# EAGLE design Schematic (EAGLE 6.5.0)
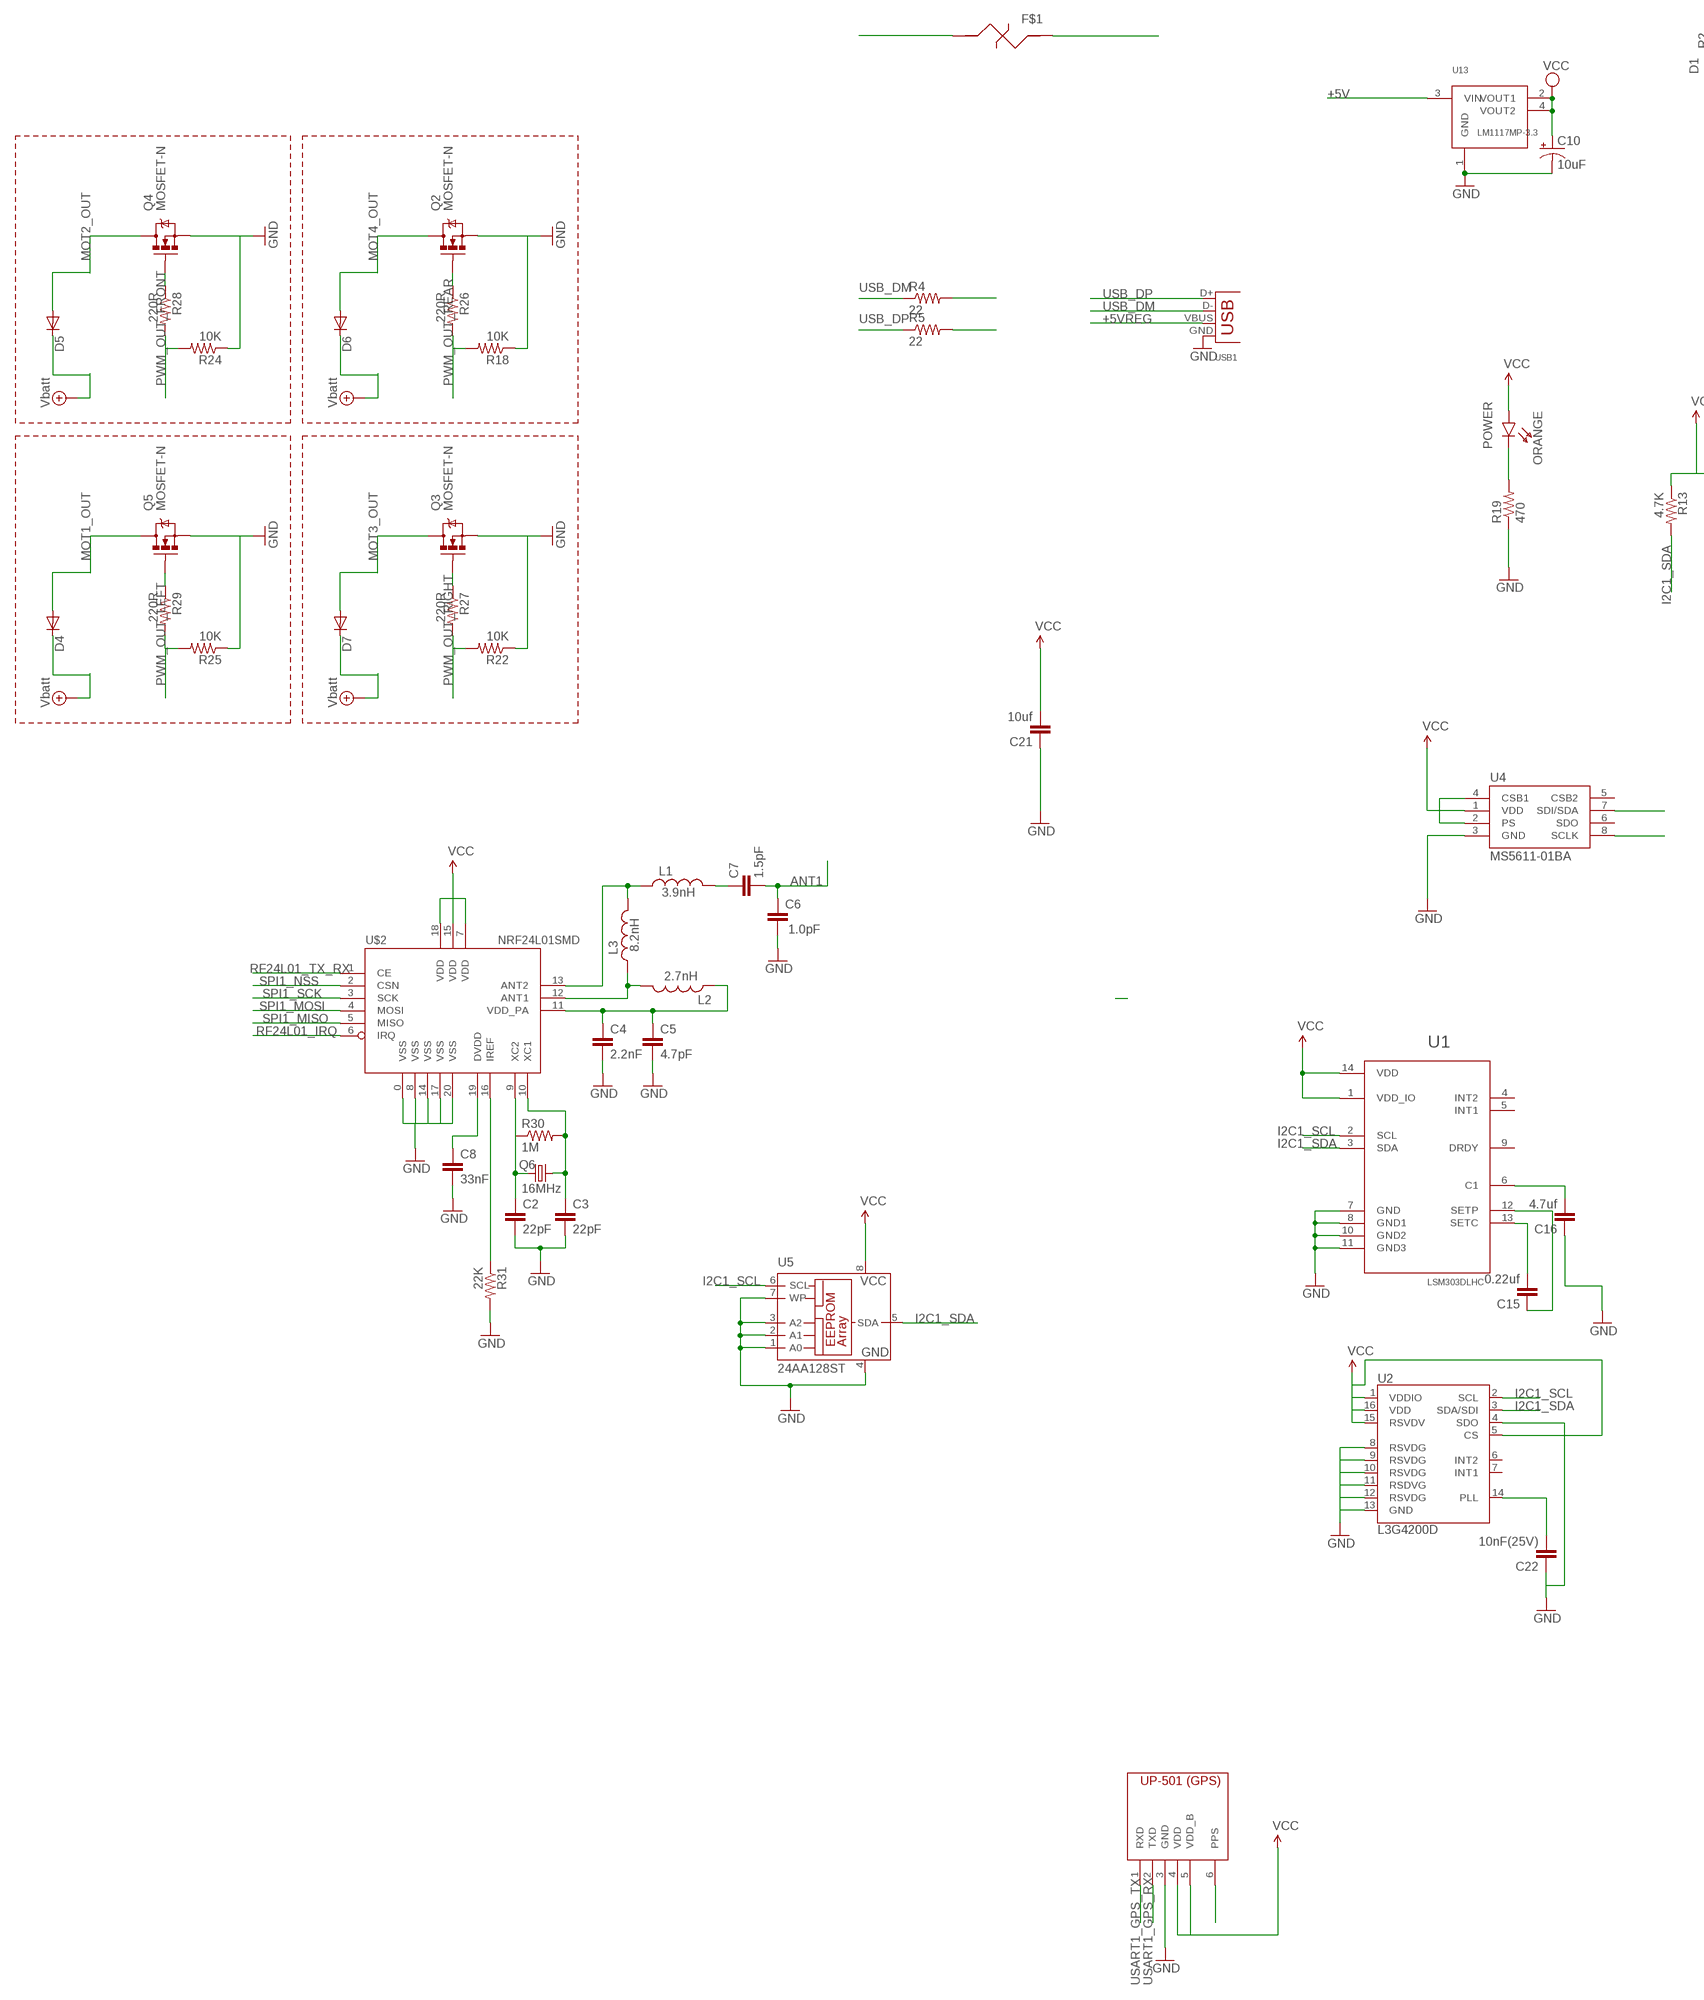
[diagram p0: schematic, sheet 1, part 1 of 2]
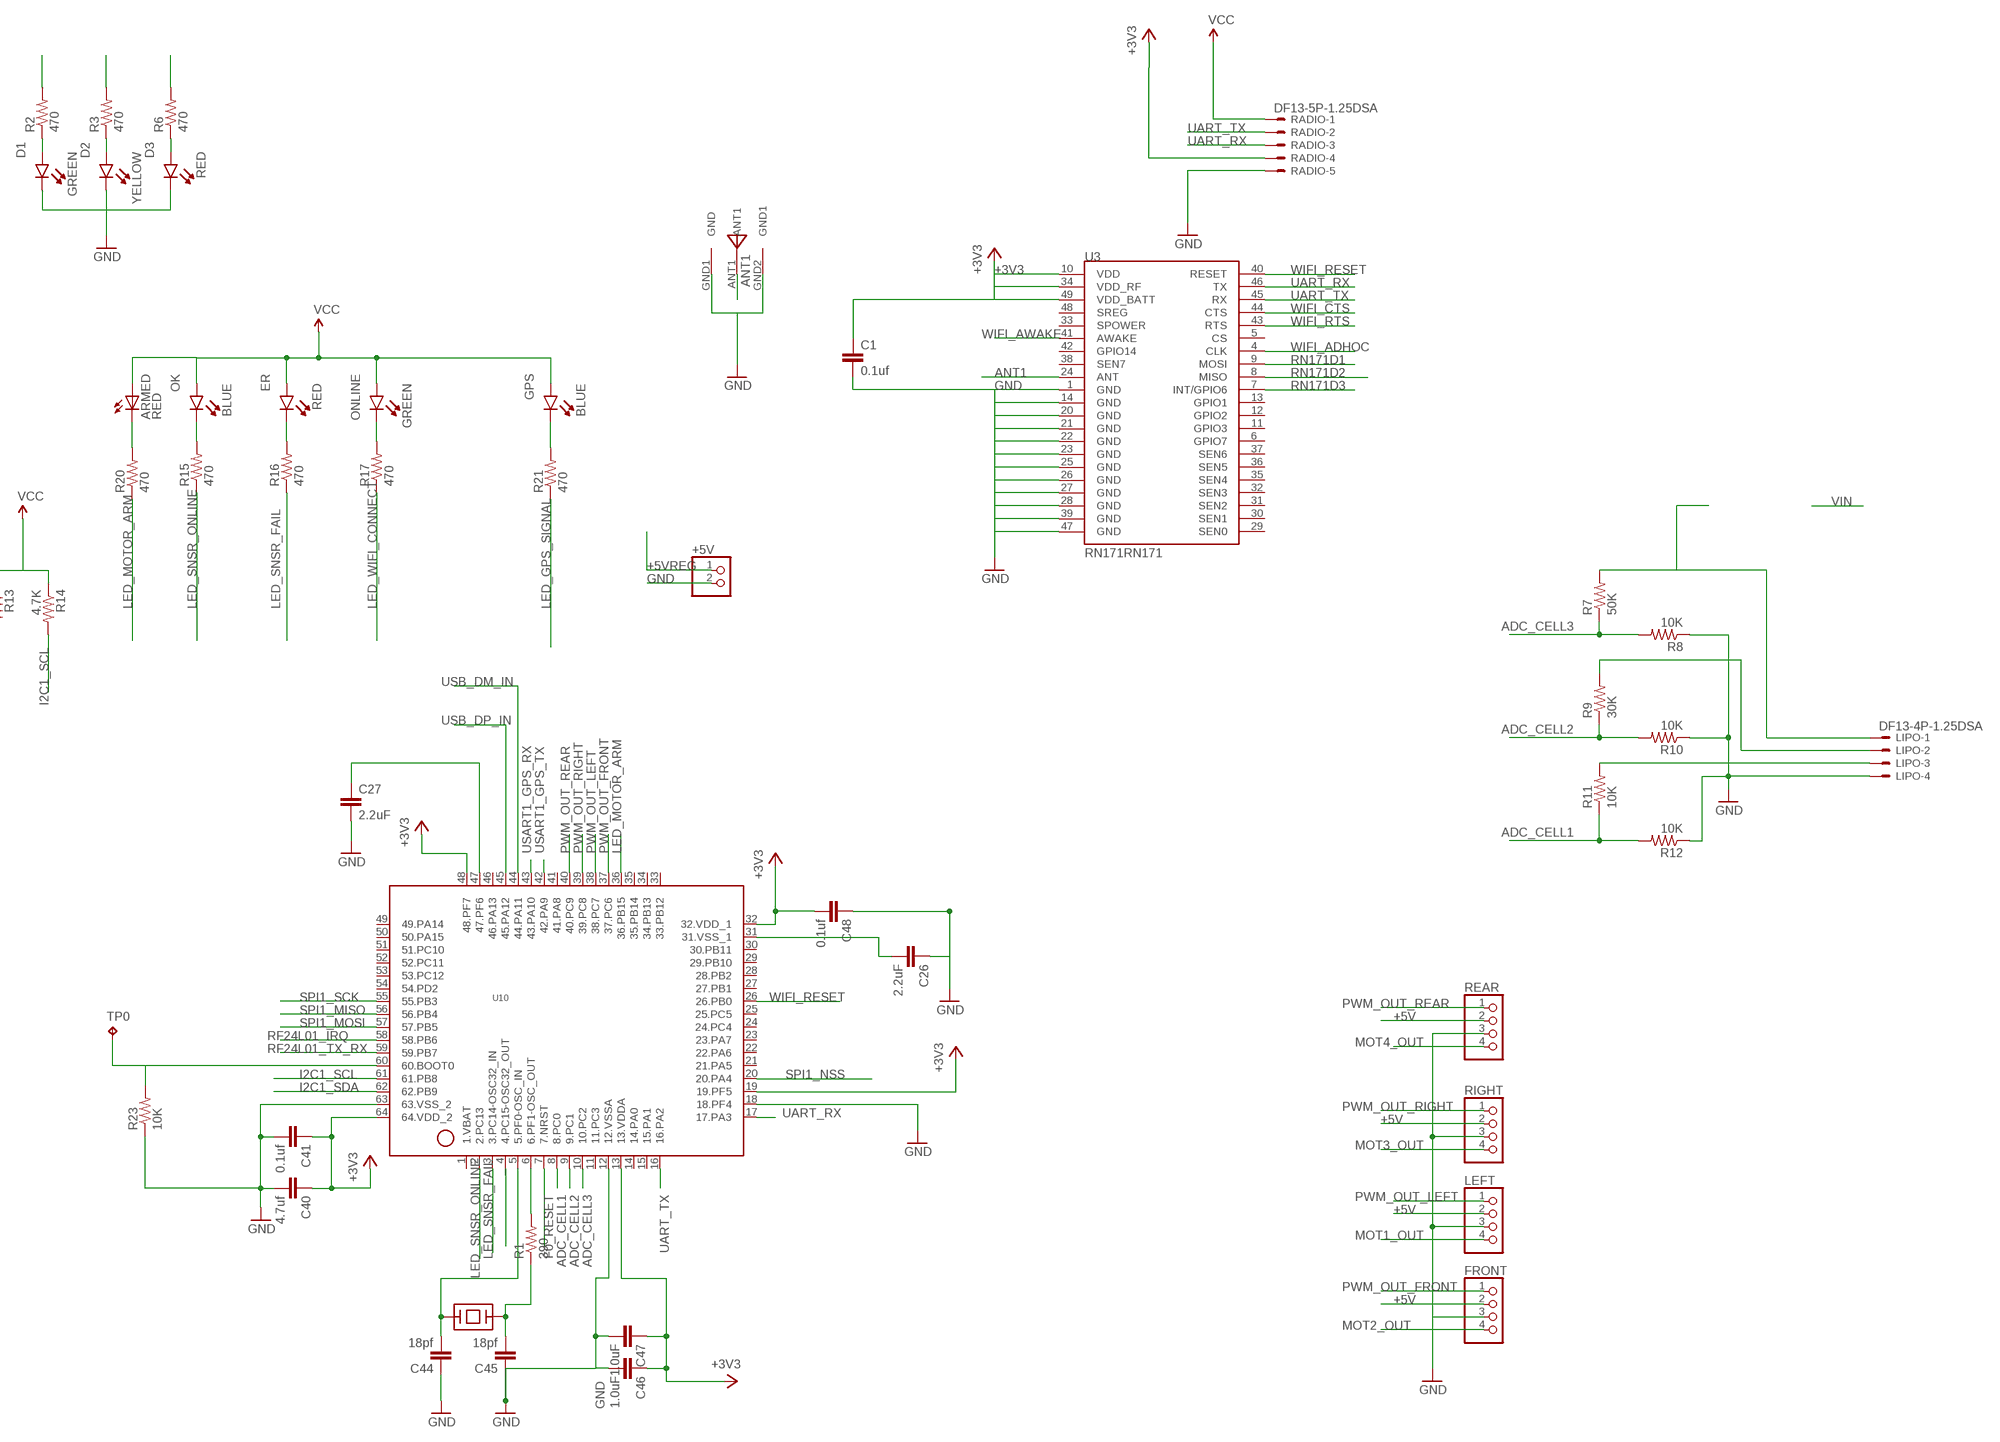
[diagram p1: schematic, sheet 1, part 2 of 2]

## Parts
+5V  PINHD-1X2  [1X02]
ARMED  RED  LED-REDLILYPAD  [LED-1206]
C1  0.1uf  CAP0805  [0805]
C2  22pF  CAP0805  [0805]
C3  22pF  CAP0805  [0805]
C4  2.2nF  CAP0805  [0805]
C5  4.7pF  CAP0805  [0805]
C6  1.0pF  CAP0805  [0805]
C7  1.5pF  CAP0805  [0805]
C8  33nF  CAP0805  [0805]
C10  10uF  CPOL-USCT3528  [CT3528]
C15  0.22uf  CAP0805  [0805]
C16  4.7uf  CAP0805  [0805]
C21  10uf  CAP0805  [0805]
C22  10nF(25V)  CAP0805  [0805]
C26  2.2uF  CAP0805  [0805]
C27  2.2uF  CAP0805  [0805]
C40  4.7uf  CAP0805  [0805]
C41  0.1uf  CAP0805  [0805]
C44  18pf  CAP0805  [0805]
C45  18pf  CAP0805  [0805]
C46  1.0uF  CAP0805  [0805]
C47  1.0uF  CAP0805  [0805]
C48  0.1uf  CAP0805  [0805]
D1  GREEN  SMD_LED0805  [LED0805]
D2  YELLOW  SMD_LED0805  [LED0805]
D3  RED  SMD_LED0805  [LED0805]
D4  DIODE-MINIMELF  [MINIMELF]
D5  DIODE-MINIMELF  [MINIMELF]
D6  DIODE-MINIMELF  [MINIMELF]
D7  DIODE-MINIMELF  [MINIMELF]
ER  RED  SMD_LED0805  [LED0805]
F1  1206L050_FUSE  [1206L050_FUSE]
FRONT  PINHD-1X4  [1X04]
GPS  BLUE  SMD_LED0805  [LED0805]
L1  3.9nH  INDUCTOR0402  [C0402]
L2  2.7nH  INDUCTOR0402  [C0402]
L3  8.2nH  INDUCTOR0402  [C0402]
LEFT  PINHD-1X4  [1X04]
LIPO  DF13-4P-1.25DSA  [DF13-4P-1.25DSA]
OK  BLUE  SMD_LED0805  [LED0805]
ONLINE  GREEN  SMD_LED0805  [LED0805]
POWER  ORANGE  SMD_LED0805  [LED0805]
Q1  ABRACON_ABM7  [ABRACON_ABM7_CERAMIC_XTAL]
Q2  MOSFET-N  MOSFET-NCHANNELSMD  [SOT23-3]
Q3  MOSFET-N  MOSFET-NCHANNELSMD  [SOT23-3]
Q4  MOSFET-N  MOSFET-NCHANNELSMD  [SOT23-3]
Q5  MOSFET-N  MOSFET-NCHANNELSMD  [SOT23-3]
Q6  16MHz  CRYSTAL5X3  [CRYSTAL-SMD-5X3]
R1  390  RESISTOR0805-RES  [0805]
R2  470  RESISTOR0805-RES  [0805]
R3  470  RESISTOR0805-RES  [0805]
R4  22  RESISTOR0805-RES  [0805]
R5  22  RESISTOR0805-RES  [0805]
R6  470  RESISTOR0805-RES  [0805]
R7  50K  RESISTOR0805-RES  [0805]
R8  10K  RESISTOR0805-RES  [0805]
R9  30K  RESISTOR0805-RES  [0805]
R10  10K  RESISTOR0805-RES  [0805]
R11  10K  RESISTOR0805-RES  [0805]
R12  10K  RESISTOR0805-RES  [0805]
R13  4.7K  RESISTOR0805-RES  [0805]
R14  4.7K  RESISTOR0805-RES  [0805]
R15  470  RESISTOR0805-RES  [0805]
R16  470  RESISTOR0805-RES  [0805]
R17  470  RESISTOR0805-RES  [0805]
R18  10K  R-US_R0603  [R0603]
R19  470  RESISTOR0805-RES  [0805]
R20  470  RESISTOR0805-RES  [0805]
R21  470  RESISTOR0805-RES  [0805]
R22  10K  R-US_R0603  [R0603]
R23  10K  RESISTOR0805-RES  [0805]
R24  10K  R-US_R0603  [R0603]
R25  10K  R-US_R0603  [R0603]
R26  220R  R-US_R0603  [R0603]
R27  220R  R-US_R0603  [R0603]
R28  220R  R-US_R0603  [R0603]
R29  220R  R-US_R0603  [R0603]
R30  1M  RESISTOR0805-RES  [0805]
R31  22K  RESISTOR0402-RES  [0402-RES]
RADIO  DF13-5P-1.25DSA  [DF13-5P-1.25DSA]
REAR  PINHD-1X4  [1X04]
RIGHT  PINHD-1X4  [1X04]
TP0  TPTP15R  [TP15R]
U1  LSM303DLHC  [LGA3X5X1-14L]
U2  L3G4200D  [LGA16-4X4]
U3  RN171RN171  [RN171]
U4  MS5611-01BA  [MS5611-01BA]
U5  24AA128ST  [TSSOP8]
U10  STM32F051XXX  [STM32F051XXX_LPFP64]
U13  LM1117MP-3.3  LM1117  [SOT223]
U$1  U.FLCONNECTOR  [U.FLCONNECTOR]
U$2  NRF24L01SMD  [QFN20]
U$4  UP501  [UP-501]
USB1  DX2R005HN2E700  USB-MB-S  [USB-MB-S]

## Nets
+3V3: ARMED.A C1.1 C10.+ C21.2 C40.1 C41.1 C46.1 C47.1 C48.2 ER.P$1(A) GPS.P$1(A) OK.P$1(A) ONLINE.P$1(A) POWER.P$1(A) R13.1 R14.1 RADIO.4 U1.1(VDD_IO) U1.14(VDD) U2.1(VDDIO) U2.5(CS) U2.15(RSVDV) U2.16(VDD) U3.10(VDD) U3.34(VDD_RF) U3.49(VDD_BATT) U4.1(VDD) U4.2(PS) U4.4(CSB1) U5.8(VCC) U10.13(13.VDDA) U10.19(19.PF5) U10.32(32.VDD_1) U10.48(48.PF7) U10.64(64.VDD_2) U13.2(VOUT1) U13.4(VOUT2) U$2.7(VDD) U$2.15(VDD) U$2.18(VDD) U$4.4(VDD) U$4.5(VDD_B) ; supply symbol labelled VCC
+5V: D4.C D5.C D6.C D7.C F1.P$2 FRONT.2 LEFT.2 RADIO.1 REAR.2 RIGHT.2 U13.3(VIN) ; supply symbol labelled VCC, Vbatt
+5VREG: +5V.1 F1.P$1 USB1.VBUS
ADC_CELL1: R11.1 R12.2 U10.8(8.PC0)
ADC_CELL2: R9.1 R10.2 U10.9(9.PC1)
ADC_CELL3: R7.1 R8.2 U10.10(10.PC2)
ANT1: C6.2 C7.2 U3.24(ANT) U$1.ANT1
F0_RESET: U10.7(7.NRST)
GND [power]: +5V.2 C1.2 C2.2 C3.2 C4.2 C5.2 C6.1 C8.2 C10.- C16.1 C21.1 C22.1 C26.1 C27.2 C40.2 C41.2 C44.1 C45.1 C46.2 C47.2 C48.1 D1.C D2.C D3.C FRONT.3 LEFT.3 LIPO.4 Q2.2(S) Q3.2(S) Q4.2(S) Q5.2(S) R8.1 R10.1 R12.1 R18.1 R19.1 R22.1 R23.1 R24.1 R25.1 R31.2 RADIO.5 REAR.3 RIGHT.3 U1.7(GND) U1.8(GND1) U1.10(GND2) U1.11(GND3) U2.4(SDO) U2.8(RSVDG) U2.9(RSVDG) U2.10(RSVDG) U2.11(RSDVG) U2.12(RSVDG) U2.13(GND) U3.1(GND) U3.14(GND) U3.20(GND) U3.21(GND) U3.22(GND) U3.23(GND) U3.25(GND) U3.26(GND) U3.27(GND) U3.28(GND) U3.39(GND) U3.47(GND) U4.3(GND) U5.1(A0) U5.2(A1) U5.3(A2) U5.4(GND) U5.7(WP) U10.12(12.VSSA) U10.18(18.PF4) U10.63(63.VSS_2) U13.1(GND) U$1.GND1(GND) U$1.GND2(GND1) U$2.0(VSS) U$2.8(VSS) U$2.14(VSS) U$2.17(VSS) U$2.20(VSS) U$4.3(GND) USB1.GND
I2C1_SCL: R14.2 U1.2(SCL) U2.2(SCL) U4.8(SCLK) U5.6(SCL) U10.61(61.PB8)
I2C1_SDA: R13.2 U1.3(SDA) U2.3(SDA/SDI) U4.7(SDI/SDA) U5.5(SDA) U10.62(62.PB9)
LED_GPS_SIGNAL: R21.1 U$4.6(PPS)
LED_MOTOR_ARM: R20.1 U10.36(36.PB15)
LED_SNSR_FAIL: R16.1 U10.3(3.PC14-OSC32_IN)
LED_SNSR_ONLINE: R15.1 U10.2(2.PC13)
LED_WIFI_CONNECT: R17.1 U10.4(4.PC15-OSC32_OUT)
MOT1_OUT: D4.A LEFT.4 Q5.3(D)
MOT2_OUT: D5.A FRONT.4 Q4.3(D)
MOT3_OUT: D7.A Q3.3(D) RIGHT.4
MOT4_OUT: D6.A Q2.3(D) REAR.4
N$1: D1.P$1(A) R2.1
N$3: C2.1 Q6.1 R30.1 U$2.9(XC2)
N$4: D2.P$1(A) R3.1
N$5: R1.2 U10.6(6.PF1-OSC_OUT)
N$6: D3.P$1(A) R6.1
N$7: C3.1 Q6.3 R30.2 U$2.10(XC1)
N$8: C16.2 U1.6(C1)
N$9: OK.C R15.2
N$10: L1.1 L3.2 U$2.13(ANT2)
N$11: C4.1 C5.1 L2.1 U$2.11(VDD_PA)
N$12: C15.1 U1.12(SETP)
N$13: C15.2 U1.13(SETC)
N$14: ER.C R16.2
N$15: ARMED.C R20.2
N$16: LIPO.3 R11.2
N$17: LIPO.2 R9.2
N$18: L2.2 L3.1 U$2.12(ANT1)
N$19: ONLINE.C R17.2
N$20: C7.1 L1.2
N$21: POWER.C R19.2
N$22: R31.1 U$2.16(IREF)
N$23: C8.1 U$2.19(DVDD)
N$25: R23.2 TP0.TP U10.60(60.BOOT0)
N$27: C22.2 U2.14(PLL)
N$30: GPS.C R21.2
N$31: C26.2 U10.31(31.VSS_1)
N$32: C27.1 U10.47(47.PF6)
N$45: Q5.1(G) R29.1
N$46: Q4.1(G) R28.1
N$47: Q2.1(G) R26.1
N$48: Q3.1(G) R27.1
OSC_IN: C44.2 Q1.P$1 U10.5(5.PF0-OSC_IN)
OSC_OUT: C45.2 Q1.P$2 R1.1
PWM_OUT_FRONT: FRONT.1 R24.2 R28.2 U10.37(37.PC6)
PWM_OUT_LEFT: LEFT.1 R25.2 R29.2 U10.38(38.PC7)
PWM_OUT_REAR: R18.2 R26.2 REAR.1 U10.40(40.PC9)
PWM_OUT_RIGHT: R22.2 R27.2 RIGHT.1 U10.39(39.PC8)
RF24L01_IRQ: U10.58(58.PB6) U$2.6(IRQ)
RF24L01_TX_RX: U10.59(59.PB7) U$2.1(CE)
RN171D1: R2.2 U3.9(MOSI)
RN171D2: R3.2 U3.8(MISO)
RN171D3: R6.2 U3.7(INT/GPIO6)
SPI1_MISO: U10.56(56.PB4) U$2.5(MISO)
SPI1_MOSI: U10.57(57.PB5) U$2.4(MOSI)
SPI1_NSS: U10.20(20.PA4) U$2.2(CSN)
SPI1_SCK: U10.55(55.PB3) U$2.3(SCK)
UART_RX: RADIO.3 U3.46(TX) U10.17(17.PA3)
UART_TX: RADIO.2 U3.45(RX) U10.16(16.PA2)
USART1_GPS_RX: U10.43(43.PA10) U$4.2(TXD)
USART1_GPS_TX: U10.42(42.PA9) U$4.1(RXD)
USB_DM: R4.1 USB1.D-
USB_DM_IN: R4.2 U10.44(44.PA11)
USB_DP: R5.1 USB1.D+
USB_DP_IN: R5.2 U10.45(45.PA12)
VIN_PROTECTED: LIPO.1 R7.2
WIFI_ADHOC: U3.4(CLK)
WIFI_AWAKE: U3.41(AWAKE)
WIFI_CTS: U3.44(CTS)
WIFI_RESET: U3.40(RESET) U10.26(26.PB0)
WIFI_RTS: U3.43(RTS)
Unconnected: U1.4(INT2) U1.5(INT1) U1.9(DRDY) U2.6(INT2) U2.7(INT1) U3.5(CS) U3.6(GPIO7) U3.11(GPIO3) U3.12(GPIO2) U3.13(GPIO1) U3.29(SEN0) U3.30(SEN1) U3.31(SEN2) U3.32(SEN3) U3.33(SPOWER) U3.35(SEN4) U3.36(SEN5) U3.37(SEN6) U3.38(SEN7) U3.42(GPIO14) U3.48(SREG) U4.5(CSB2) U4.6(SDO) U10.1(1.VBAT) U10.11(11.PC3) U10.14(14.PA0) U10.15(15.PA1) U10.21(21.PA5) U10.22(22.PA6) U10.23(23.PA7) U10.24(24.PC4) U10.25(25.PC5) U10.27(27.PB1) U10.28(28.PB2) U10.29(29.PB10) U10.30(30.PB11) U10.33(33.PB12) U10.34(34.PB13) U10.35(35.PB14) U10.41(41.PA8) U10.46(46.PA13) U10.49(49.PA14) U10.50(50.PA15) U10.51(51.PC10) U10.52(52.PC11) U10.53(53.PC12) U10.54(54.PD2)

## Library data of the parts
+5V = pinhead:PINHD-1X2: PIN HEADER
ARMED = SparkFun-LED:LED-RED: Assorted Red LEDs LilyPad 1206- DIO-09912 1206- DIO-00809 0603- DIO-00819; PROD_ID: DIO-09912
C1-C8 C26 C27 C40 C41 C44-C48 = SparkFun-Passives:CAP: Capacitor Standard 0603 ceramic capacitor, and 0.1" leaded capacitor.
C10 = rcl:CPOL-US: POLARIZED CAPACITOR, American symbol
C15 C16 C21 C22 = SparkFun:CAP: Capacitor Standard 0603 ceramic capacitor, and 0.1" leaded capacitor.
D1-D3 ER GPS OK ONLINE POWER = SoftwareLogisticsParts:SMD_LED0805
D4-D7 = palmquad_alpha:DIODE-: DIODE
F1 = SoftwareLogisticsParts:1206L050_FUSE
FRONT LEFT REAR RIGHT = pinhead:PINHD-1X4: PIN HEADER
L1-L3 = SparkFun:INDUCTOR: Inductors Basic Inductor/Choke - 0603 and 1206. Footprints are not proven and vary greatly between part numbers.
LIPO = pixhawk2:DF13-4P-1.25?
Q1 = Nwazet.Go:ABRACON_ABM7
Q2-Q5 = palmquad_alpha:MOSFET-NCHANNEL
Q6 = SparkFun:CRYSTAL: Crystals Various standard crystals. Proven footprints. Spark Fun Electronics SKU : COM-00534
R1-R17 R19-R21 R23 R30 = SparkFun-Passives:RESISTOR: Resistor Basic schematic elements and footprints for 0603, 1206, and PTH resistors.
R18 R22 R24-R29 = rcl:R-US_: RESISTOR, American symbol
R31 = SparkFun:RESISTOR: Resistor Basic schematic elements and footprints for 0603, 1206, and PTH resistors.
RADIO = pixhawk2:DF13-5P-1.25?
TP0 = testpad:TP: Test pad
U1 = SoftwareLogisticsParts (2):LSM303DLHC: 3D Accelerometer and 3D Magenetometer Module ST Micro Electronics
U2 = SparkFun:L3G4200D: L3G4200D Three-axis, digital output gyroscope The L3G4200D is a low-power three-axis angular rate sensor, has a full scale of ±250/±500/±2000 dps and is capable of measuring rates with a user-selectable bandwidth. It includes a sensing element and an IC interface capable of providing the measured angular rate to the external world through a digital interface (I2C/SPI). Package: 4x4x1.1 LGA-16 (LGA16-4x4.PAC)
U3 = SparkFun-RF:RN171: WiFi Module
U4 = 3DRobotics:MS5611-01BA: MS5611-01BA The MS5611-01BA is a new generation of high resolution altimeter sensors from MEAS Switzerland with SPI and I 2 C bus interface. It is optimized for altimeters and variometers with an altitude resolution of 10 cm. The sensor module includes a high linearity pressure sensor and an ultra low power 24 bit ?? ADC with internal factory calibrated coefficients. It provides a precise digital 24 Bit pressure and temperature value and different operation modes that allow the user to optimize for conversion speed and current consumption. A high resolution temperature output allows the implementation of an altimeter/thermometer function without any additional sensor. The MS5611-01BA can be interfaced to virtually any microcontroller. The communication protocol is simple, without the need of programming internal registers in the device. Small dimensions of only 5.0 mm x 3.0 mm and a height of 1.7 mm allow for integration in mobile devices. This new sensor module generation is based on leading MEMS technology and latest benefits from MEAS Switzerland proven experience and know-how in high volume manufacturing of altimeter modules, which have been widely used for over a decade. The sensing principle employed leads to very low hysteresis and high stability of both pressure and temperature signal. High resolution module, 10 cm Fast conversion down to 1 ms Low power, 1 µA (standby < 0.15 µA) QFN package 5.0 x 3.0 x 1.7 mm3 Supply voltage 1.8 to 3.6 V Integrated digital pressure sensor (24 bit ?? ADC) Operating range: 10 to 1200 mbar, -40 to +85 °C I2C and SPI interface up to 20 MHz No external components (Internal oscillator) Excellent long term stability; DATASHEET: http://www.meas-spec.com/downloads/MS5611-01BA01.pdf; LINK: http://www.meas-spec.com/product/t_product.aspx?id=8503#; MFGPN: MS5611-01BA
U5 = microchip:24*: Serial EEPROM I2C; MF: MICROCHIP; MPN: 24AA128-I/ST; OC_FARNELL: unknown; OC_NEWARK: 92C6843
U10 = Nwazet.Go:STM32F051XXX
U13 = GHI:LM1117
U$1 = SoftwareLogisticsParts:U.FLCONNECTOR
U$2 = SparkFun-RF:NRF24L01: 2.4GHz Low Power Transceiver This is the very popular, low cost, very low power RF transceiver from Nordic Semiconductor. Simple SPI interface. SKU: COM-00690
U$4 = SoftwareLogisticsParts (2):UP501
USB1 = con-usb-3:USB: USB Connectors

## Net classes
0 default: width 0.178 mm, drill 0.381 mm, clearance 0.178 mm

## Board
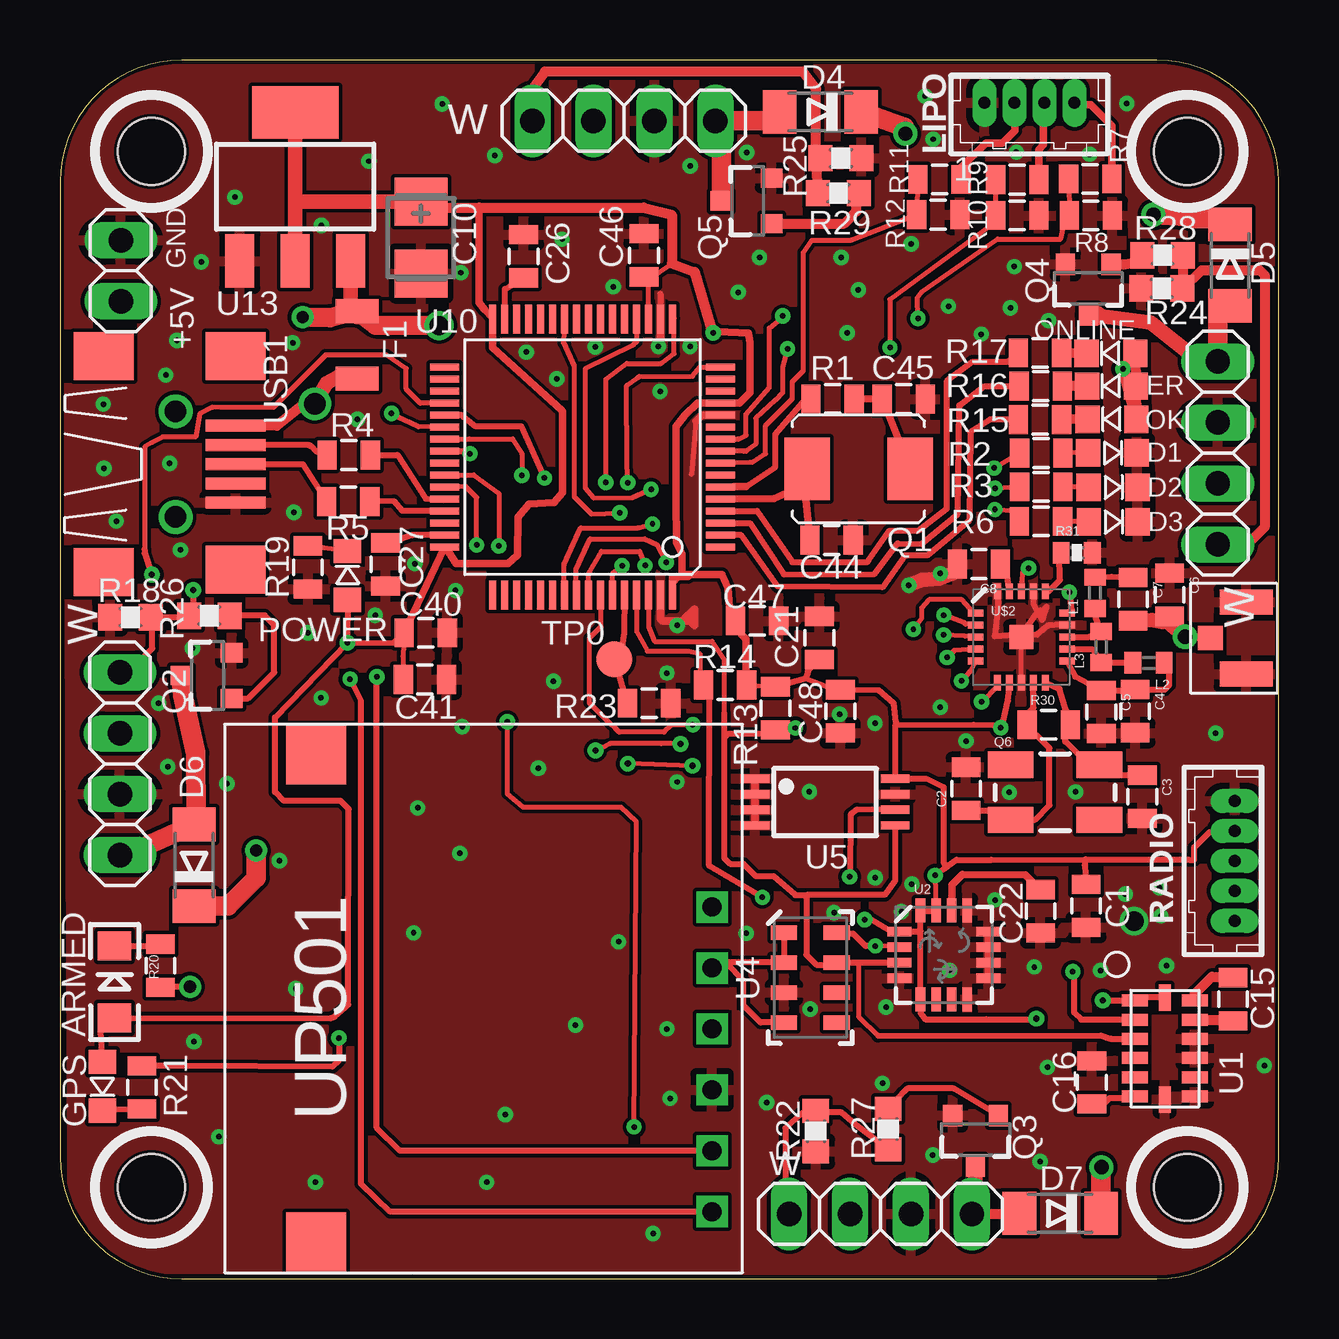
[diagram p2: board, top side]
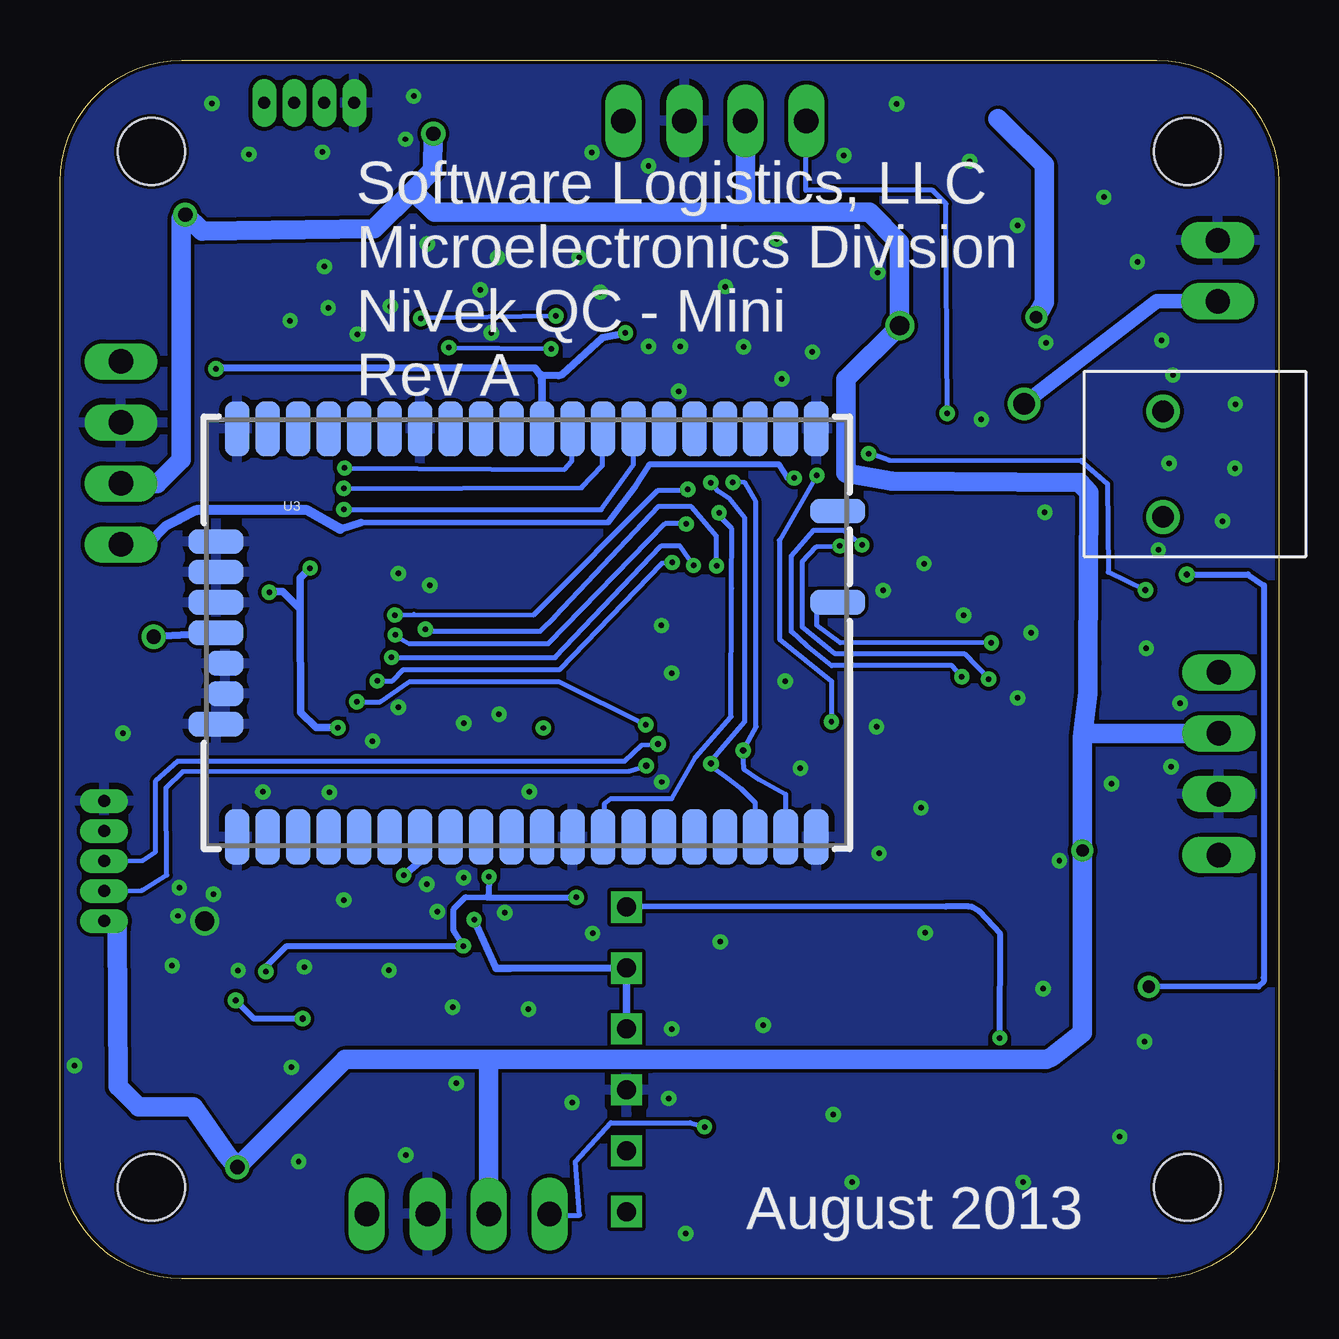
[diagram p3: board, bottom side, seen from below]

Size 50.8 x 50.8 mm. Coordinates in mm from the lower left corner, seen from the top.
Outline: 45.72,50.8 5.08,50.8 arc90 0,45.72 0,5.08 arc90 5.08,0 45.72,0 arc90 50.8,5.08 50.8,45.72 arc90 45.72,50.8
Copper layers (1*16): Top 0.035mm / dielectric 1.5mm / Bottom 0.035mm
Design rules "default *": minimum track width 6mil, minimum drill 4mil, track to track 6mil, track to pad 6mil, pad to pad 6mil, via to via 6mil, smd to smd 0mil, copper to edge 6mil, drill to drill 6mil, minimum pad ring 10mil, minimum via ring 8mil, stop-mask expansion 4mil, vias tented up to drill 12mil, thermal gap 10mil
Holes 2.79 mm at 46.99,46.99 3.81,3.81 3.81,46.99 46.99,3.81

### Footprints (pad centres in the part's own frame; a part is rotated, then mirrored left to right if it is on the bottom)
1X02 = drill 1.016 long: 1 -1.27,0; 2 1.27,0
LED-1206 = smd 1.2 x 1.4: A -1.5,0; C 1.5,0
0805 = smd 0.8 x 1.2: 1 -0.9,0; 2 0.9,0
CT3528 = smd 2 x 2.2: + -1.5,0; - 1.5,0
LED0805 = smd 1.143 x 1.016: C 0,1.016; P$1 0,-1.016
MINIMELF = smd 1.4 x 1.8: A 1.7,0; C -1.7,0
1206L050_FUSE = smd 1 x 1.8: P$1 -1.4,0; P$2 1.4,0
1X04 = drill 1.016 long: 1 -3.81,0; 2 -1.27,0; 3 1.27,0; 4 3.81,0
C0402 = smd 0.7 x 0.9: 1 -0.65,0; 2 0.65,0
DF13-4P-1.25DSA = drill 0.5 pad 0.8 long: 1 -1.875,0; 2 -0.625,0; 3 0.625,0; 4 1.875,0
ABRACON_ABM7_CERAMIC_XTAL = smd 1.9 x 2.6: P$1 -2.15,0; P$2 2.15,0
SOT23-3 = smd 0.8 x 0.9: 1 -0.95,-1; 2 0.95,-1; 3 0,1.1
CRYSTAL-SMD-5X3 = smd 1.9 x 1.1: 1 -1.85,-1.15; 2 1.85,-1.15; 3 1.85,1.15; 4 -1.85,1.15
R0603 = smd 1 x 1.1: 1 -0.85,0; 2 0.85,0
0402-RES = smd 0.7 x 0.9: 1 -0.65,0; 2 0.65,0
DF13-5P-1.25DSA = drill 0.5 pad 0.8 long: 1 -2.5,0; 2 -1.25,0; 3 0,0; 4 1.25,0; 5 2.5,0
TP15R = smd 1.5 x 1.5: TP 0,0
LGA3X5X1-14L = smd 1.1 x 0.5: 1 -1.25,2; 2 -1.25,1.2; 3 -1.25,0.4; 4 -1.25,-0.4; 5 -1.25,-1.2; 6 -1.25,-2; 8 1.25,-2; 9 1.25,-1.2; 10 1.25,-0.4; 11 1.25,0.4; 12 1.25,1.2; 13 1.25,2 | smd 0.5 x 1.1: 7 0,-2.125; 14 0,2.125
LGA16-4X4 = smd 1 x 0.4: 1 -1.85,0.975; 2 -1.85,0.325; 3 -1.85,-0.325; 4 -1.85,-0.975; 9 1.85,-0.975; 10 1.85,-0.325; 11 1.85,0.325; 12 1.85,0.975 | smd 0.4 x 1: 5 -0.975,-1.85; 6 -0.325,-1.85; 7 0.325,-1.85; 8 0.975,-1.85; 13 0.975,1.85; 14 0.325,1.85; 15 -0.325,1.85; 16 -0.975,1.85
RN171 = smd 1.016 x 2.286: 1 12.065,8.509; 2 10.795,8.509; 3 9.525,8.509; 4 8.255,8.509; 5 6.985,8.509; 6 5.715,8.509; 7 4.445,8.509; 8 3.175,8.509; 9 1.905,8.509; 10 0.635,8.509; 11 -0.635,8.509; 12 -1.905,8.509; 13 -3.175,8.509; 14 -4.445,8.509; 15 -5.715,8.509; 16 -6.985,8.509; 17 -8.255,8.509; 18 -9.525,8.509; 19 -10.795,8.509; 20 -12.065,8.509; 28 -12.065,-8.509; 29 -10.795,-8.509; 30 -9.525,-8.509; 31 -8.255,-8.509; 32 -6.985,-8.509; 33 -5.715,-8.509; 34 -4.445,-8.509; 35 -3.175,-8.509; 36 -1.905,-8.509; 37 -0.635,-8.509; 38 0.635,-8.509; 39 1.905,-8.509; 40 3.175,-8.509; 41 4.445,-8.509; 42 5.715,-8.509; 43 6.985,-8.509; 44 8.255,-8.509; 45 9.525,-8.509; 46 10.795,-8.509; 47 12.065,-8.509 | smd 2.286 x 1.016: 21 -12.954,3.81; 22 -12.954,2.54; 23 -12.954,1.27; 24 -12.954,0; 27 -12.954,-3.81; 48 12.954,5.08; 49 12.954,1.27 | smd 1.524 x 1.016: 25 -12.573,-1.27; 26 -12.573,-2.54
MS5611-01BA = smd 1.1 x 0.6: 1 -1.1,1.875; 2 -1.1,0.625; 3 -1.1,-0.625; 4 -1.1,-1.875; 5 1.1,-1.875; 6 1.1,-0.625; 7 1.1,0.625; 8 1.1,1.875
TSSOP8 = smd 0.35 x 1.2: 1 -0.975,-2.925; 2 -0.325,-2.925; 3 0.325,-2.925; 4 0.975,-2.925; 5 0.975,2.925; 6 0.325,2.925; 7 -0.325,2.925; 8 -0.975,2.925
STM32F051XXX_LPFP64 = smd 0.3 x 1.2: 1 -3.75,-5.75; 2 -3.25,-5.75; 3 -2.75,-5.75; 4 -2.25,-5.75; 5 -1.75,-5.75; 6 -1.25,-5.75; 7 -0.75,-5.75; 8 -0.25,-5.75; 9 0.25,-5.75; 10 0.75,-5.75; 11 1.25,-5.75; 12 1.75,-5.75; 13 2.25,-5.75; 14 2.75,-5.75; 15 3.25,-5.75; 16 3.75,-5.75; 33 3.75,5.75; 34 3.25,5.75; 35 2.75,5.75; 36 2.25,5.75; 37 1.75,5.75; 38 1.25,5.75; 39 0.75,5.75; 40 0.25,5.75; 41 -0.25,5.75; 42 -0.75,5.75; 43 -1.25,5.75; 44 -1.75,5.75; 45 -2.25,5.75; 46 -2.75,5.75; 47 -3.25,5.75; 48 -3.75,5.75 | smd 1.2 x 0.3: 17 5.75,-3.75; 18 5.75,-3.25; 19 5.75,-2.75; 20 5.75,-2.25; 21 5.75,-1.75; 22 5.75,-1.25; 23 5.75,-0.75; 24 5.75,-0.25; 25 5.75,0.25; 26 5.75,0.75; 27 5.75,1.25; 28 5.75,1.75; 29 5.75,2.25; 30 5.75,2.75; 31 5.75,3.25; 32 5.75,3.75; 49 -5.75,3.75; 50 -5.75,3.25; 51 -5.75,2.75; 52 -5.75,2.25; 53 -5.75,1.75; 54 -5.75,1.25; 55 -5.75,0.75; 56 -5.75,0.25; 57 -5.75,-0.25; 58 -5.75,-0.75; 59 -5.75,-1.25; 60 -5.75,-1.75; 61 -5.75,-2.25; 62 -5.75,-2.75; 63 -5.75,-3.25; 64 -5.75,-3.75
SOT223 = smd 1.219 x 2.235: 1 -2.311,-3.099; 2 0,-3.099; 3 2.311,-3.099 | smd 3.6 x 2.2: 4 0,3.099
U.FLCONNECTOR = smd 1 x 1.05: ANT1 0,-1.5 | smd 1.05 x 2.2: GND1 -1.5,0; GND2 1.5,0
QFN20 = smd 1 x 1: 0 0,0 | smd 0.65 x 0.3: 1 -1.9,1; 2 -1.9,0.5; 3 -1.9,0; 4 -1.9,-0.5; 5 -1.9,-1; 11 1.9,-1; 12 1.9,-0.5; 13 1.9,0; 14 1.9,0.5; 15 1.9,1 | smd 0.3 x 0.65: 6 -1,-1.9; 7 -0.5,-1.9; 8 0,-1.9; 9 0.5,-1.9; 10 1,-1.9; 16 1,1.9; 17 0.5,1.9; 18 0,1.9; 19 -0.5,1.9; 20 -1,1.9
UP-501 = drill 0.8 square: 1 -8.89,-8.89; 2 -6.35,-8.89; 3 -3.81,-8.89; 4 -1.27,-8.89; 5 1.27,-8.89; 6 3.81,-8.89 | smd 2.5 x 2.5: 7 10.16,7.62; 8 -10.16,7.62
USB-MB-S = smd 2.5 x 0.5: D+ 2.5,0; D- 2.5,0.8; GND 2.5,-1.6; ID 2.5,-0.8; VBUS 2.5,1.6 | smd 2.5 x 2: P$1 -3,-4.5; P$2 -3,4.5; P$3 2.5,-4.4; P$4 2.5,4.5 | drill 0.9: P$5 0,2.2; P$6 0,-2.2

### Placement (x,y rotation side)
+5V  2.54,42.01 90 top
ARMED  2.28,12.38 90 top
C1  42.77,15.54 270 top
C2  37.77,20.42 90 top
C3  45.12,20.09 270 top
C4  44.82,23.66 270 top
C5  43.4,23.62 270 top
C6  46.25,28.51 270 top
C7  44.73,28.32 270 top
C8  38.3,29.79 180 top
C10  15.05,43.4 270 top
C15  48.9,11.65 90 top
C16  43.01,8.18 270 top
C21  31.66,26.71 270 top
C22  40.87,15.31 90 top
C26  19.33,42.61 270 top
C27  13.57,29.77 270 top
C40  15.24,26.93 0 top
C41  15.21,24.98 0 top
C44  32.16,30.79 180 top
C45  35.17,36.67 180 top
C46  24.34,42.66 90 top
C47  29.06,27.42 0 top
C48  32.53,23.65 90 top
D1  43.87,34.43 270 top
D2  43.9,32.99 270 top
D3  43.9,31.55 270 top
D4  31.7,48.64 180 top
D5  48.77,42.25 270 top
D6  5.59,17.24 90 top
D7  41.69,2.72 180 top
ER  43.83,37.21 90 top
F1  12.39,38.93 90 top
FRONT  48.26,34.42 90 top
GPS  1.77,8.02 180 top
L1  43.14,28.59 90 top
L2  45.37,25.67 180 top
L3  43.39,26.33 90 top
LEFT  23.5,48.26 0 top
LIPO  40.41,49.01 180 top
OK  43.85,35.83 90 top
ONLINE  43.81,38.57 90 top
POWER  11.98,29.31 0 top
Q1  33.29,33.76 0 top
Q2  6.16,25.14 90 top
Q3  38.16,5.8 180 top
Q4  42.86,41.28 180 top
Q5  28.67,44.93 90 top
Q6  41.47,20.27 0 top
R1  32.21,36.68 180 top
R2  40.9,34.41 180 top
R3  40.9,33 180 top
R4  12.04,34.33 0 top
R5  12.02,32.4 0 top
R6  40.89,31.57 180 top
R7  42.94,45.84 0 top
R8  42.97,44.32 180 top
R9  39.9,45.81 0 top
R10  39.9,44.32 180 top
R11  36.66,45.82 0 top
R12  36.61,44.36 180 top
R13  29.82,23.77 270 top
R14  27.72,24.74 180 top
R15  40.85,35.81 0 top
R16  40.88,37.21 0 top
R17  40.85,38.59 0 top
R18  2.94,27.57 0 top
R19  10.33,29.65 90 top
R20  4.18,13.05 90 top
R21  3.41,7.98 270 top
R22  31.51,6.15 90 top
R23  24.56,23.99 180 top
R24  45.92,41.28 0 top
R25  32.55,46.71 180 top
R26  6.23,27.64 180 top
R27  34.52,6.24 270 top
R28  45.96,42.66 0 top
R29  32.45,45.25 180 top
R30  41.21,23.09 0 top
R31  42.38,30.26 0 top
RADIO  48.96,17.41 90 top
REAR  2.5,21.47 270 top
RIGHT  34.2,2.7 0 top
TP0  23.11,25.82 180 top
U1  46.05,9.6 0 top
U2  36.84,13.5 0 top
U3  31.34,26.92 0 bottom
U4  31.28,12.56 0 top
U5  31.89,19.87 270 top
U10  21.78,34.25 90 top
U13  9.8,45.52 0 top
U$1  49.44,26.7 270 top
U$2  40.07,26.75 0 top
U$4  18.29,11.68 90 top
USB1  4.82,33.95 0 top

### Tracks (layer width: path | path; a pad name or v marks a point on that pad's centre or on a via)
+3V3  (via drill 0.23, 0.25)
  Top 0.203: C40.1 14.3,25.95 C41.1 | U10.48 16.08,30.5 | R14.1 R13.1 | v36.47,16.82 U2.15 | 31.18,25.31 C21.2 | 31.1,25.02 32.17,24.61 C48.2 | U10.19 24.53,41.65 25.5,42.32 | v40.38,29.62 40.29,29.62 40.12,29.45 40.09,29.05 U$2.18 | 39.26,22.96 v39.22,22.96 v39.22,22.97
  Top 0.254: 35.87,14.48 U2.5 35.87,11.07 36.07,10.82 38.61,10.82 40.67,10.82 v40.69,10.84 | 35.87,14.48 U2.16 | 35.87,14.48 U2.1 34.62,14.47 34.55,14.54 33.73,15.03 v33.54,14.97 | POWER.P$1 v11.98,26.51 | 31.18,25.31 31.1,25.02 R13.1 | 17.7,40.39 U10.32 | v11.98,26.51 13.93,26.52 C40.1 | 42.74,17.48 38.82,17.46 37.37,17.46 36.99,17.18 | 42.74,17.48 47.05,17.48 47.07,17.46 47.28,17.46 47.28,17.98 47.91,18.6 RADIO.4 | GPS.P$1 1.7,10.3 ARMED.A 11.26,10.86 11.37,10.89 11.46,10.93 11.9,11.33 12.01,11.44 12.01,12.3 12.04,19.58 11.69,19.92 9.33,19.92 8.96,20.29 8.96,23.4 v11.98,26.51 | v43.48,11.61 U1.1 44.93,11.72 U1.14 | v42.08,28.62 42.16,27.86 U$2.15 | 34.83,23.07 U5.8 36.1,20.85 36.83,20.49 36.83,17.34 36.99,17.18 | 34.83,23.07 38.09,23.09 38.91,23.07 39.26,22.96 39.52,24.09 39.57,24.58 U$2.7 | 20.95,36.15 20.95,36 20.91,36.2 | U4.1 U4.2 27.41,13.18 U$4.5 27.36,13.13 27.78,13.13 28.5,12.42 28.5,11.39 29.2,10.68 U4.4 | C48.2 34.12,24.53 34.76,23.98 34.85,23.22 34.83,23.07 | 36.99,17.18 36.85,17.09 v36.47,16.82 | 42.74,17.48 42.71,17.24 C1.1
  Top 0.305: U2.16 U2.15 | U10.64 25.53,29.03 | 25.53,29.03 25.53,29.24 | U10.32 18.03,38.81 20.91,36.2 | U10.48 C40.1 | 16.08,30.5 16.5,29.81 18.68,29.82 19.07,30.16 19.1,31.74 19.55,32.3 20.59,32.35 20.95,32.77 20.95,36.15 | 17.48,44.65 17.48,40.69 17.7,40.39 | R14.1 28.6,24.77 28.6,26.67 28.16,27.11 C47.1 27.94,27.43 27.85,28.8 27.59,29.36 26.28,29.36 25.93,29.37 | v27.23,39.42 27.43,39.47 28.7,39.42 28.75,39.01 28.75,36.93 28.32,36.5 U10.13 26.57,36.51 26.05,36 25.68,35.52 25.68,32.51 25.7,30.69 25.93,30.2 25.93,29.37 | 25.93,29.37 26.18,29.26 25.77,29.26 25.53,29.03
  Top 0.406: ONLINE.P$1 ER.P$1 OK.P$1 v44.3,37.92 | v27.23,39.42 26.47,41.96 25.5,42.32 25.5,44.35 24.33,44.65 17.48,44.65 15.29,44.65 15.29,44.66 C10.+ | C46.1 24.43,41.76 24.53,41.65
  Top 0.61: U13.4 9.8,45.06 | 9.8,45.06 U13.2 | C10.+ 9.96,44.9 9.8,45.06
  Bottom 0.203: U3.34 35.79,17.7 35.81,17.37 | v11.98,26.51 18.29,26.52 19.25,27.23 19.25,28.14 U3.49 | v39.22,22.97 v39.23,22.97 39.23,22.97
  Bottom 0.254: v40.69,10.84 42.71,10.84 v43.48,11.61
  Bottom 0.305: U$4.4 U$4.5 32.04,12.94 32.62,12.93 v33.54,14.97 | 35.81,17.37 v36.47,16.82 | U3.10 30.71,37.01 | 30.71,37.01 30.73,37.59 30.99,37.95 44.06,37.98 44.21,38.05 v44.3,37.92 | 30.71,37.01 30.71,37.67 30.02,37.64 29.87,37.69 28.19,39.22 v27.23,39.42 | v39.22,22.97 40.13,22.97 40.76,23.6 40.79,27.8 40.79,27.91 | 40.79,27.91 41.51,28.64 42.06,28.64 v42.08,28.62 | 40.79,27.91 40.79,29.21 v40.38,29.62
+5V  (via drill 0.51, 0.6, 0.8)
  Top 0.61: U13.3 12.12,40.6 12.4,40.19
  Top 0.813: v15.8,39.73 13.15,39.75 F1.P$2 12.4,40.19 12.22,40.32 11.27,40.06 v10.11,40.08 | D4.C 35.19,48 v35.24,47.73 | v45.58,44.35 46.98,44.27 47.22,44.19 48.64,44.19 D5.C | D7.C 43.39,4.63 v43.41,4.65 | D6.C 7,15.54 8.18,16.71 v8.18,17.85
  Bottom 0.305: 49.04,14.96 RADIO.1
  Bottom 0.406: v15.8,39.73
  Bottom 0.813: v15.8,39.73 18.03,37.49 18.03,33.58 16.14,33.24 8.3,33.19 7.9,32.78 7.95,25.67 7.95,24.42 8.13,22.9 | v15.8,39.73 15.8,43.19 17.06,44.45 22.4,44.45 | v35.24,47.73 35.27,46.2 36.11,45.36 | 36.11,45.36 37.7,43.76 44.87,43.67 v45.58,44.35 45.75,44.18 45.75,34.15 46.75,33.15 FRONT.2 | 22.4,44.45 35.19,44.45 36.11,45.36 | 11.7,48.35 9.78,46.43 9.78,40.71 v10.11,40.08 | 8.13,22.9 8.18,22.54 v8.18,17.85 8.18,10.25 9.46,9.25 9.54,9.2 9.68,9.15 9.75,9.13 26.2,9.14 32.81,9.14 | RADIO.1 48.41,14.59 48.38,8.01 47.53,7.16 45.24,7.16 43.84,5.16 v43.41,4.65 38.92,9.14 32.81,9.14 | LEFT.2 22.23,44.62 22.4,44.45 | RIGHT.2 32.93,9.02 32.81,9.14 | REAR.2 7.97,22.74 8.13,22.9
+5VREG  (via drill 0.9)
  Top 0.203: F1.P$1 11.58,37.58
  Top 0.406: 11.58,37.58 9.04,35.56 USB1.VBUS
  Top 0.61: v10.62,36.47 11.12,37.32 11.58,37.58
  Bottom 0.61: +5V.1 5.08,40.74 v10.62,36.47
ADC_CELL1
  Top 0.203: R11.1 R12.2 32.98,43.29 32.77,43.28 31.34,43.28 30.99,42.77 30.99,37.85 30.53,37.39 30.53,36.68 29.41,35.56 29.41,34.39 28.85,34.04 28.75,34.04 U10.8
ADC_CELL2  (via drill 0.23)
  Top 0.203: R9.1 R10.2 38.84,43.94 34.59,40.82 34.59,40.76 v34.59,38.81 | v30.33,38.76 30.12,38 30.12,36.93 29.82,36.63 29.01,35.87 29.01,34.8 28.6,34.49 28.5,34.49 U10.9
  Bottom 0.203: v34.59,38.81 v30.33,38.76
ADC_CELL3  (via drill 0.23)
  Top 0.203: R7.1 R8.2 41.88,44.09 41.72,43.33 39.08,43.33 35.93,41.14 35.73,40.89 v35.76,40.03 | U10.10 28.25,35 28.3,35 28.6,35.15 28.59,36.02 29.57,37.13 29.57,39.62 30.18,40.13 v30.12,40.13
  Bottom 0.203: v30.12,40.13 v35.76,40.03
ANT1  (via drill 0.6)
  Top 0.254: 45.94,27.37 C6.2 | 46.78,26.88 v46.89,26.76
  Top 0.305: v46.89,26.76 U$1.ANT1
  Top 0.61: v46.89,26.76 46.05,27.47 45.94,27.37 45.52,27.45 C7.2
  Bottom 0.305: U3.24 v46.89,26.76
GND  (via drill 0.23, 0.8)
  Top 0.203: 26.51,35.74 26.31,33.53 | U$2.8 U$2.0
  Top 0.254: 25.02,41.05 U10.18 | U10.63 25.03,28.98 | 40.66,27.66 U$2.0 40.72,26.84 41.18,27.23 42.08,27.28 U$2.14 | 40.66,27.66 40.86,27.86 40.98,27.86 41.12,28 41.04,27.78 40.94,27.46 40.6,28.09 U$2.17 | U$2.20 39.09,27.98 38.97,26.78 40.12,26.87 40.66,27.66
  Top 0.305: U5.4 U5.3 U5.2 U5.1 | U2.9 U2.10 U2.11 U2.12 | U10.12 26.75,36 26.51,35.74 | U10.18 25.03,38.95 | U10.63 25.03,27.49 25.11,27.42 26.26,27.42 26.45,27.23 26.45,27.91 v25.73,27.23
  Top 0.406: 25.03,38.95 v24.94,38.86
  Top 0.61: C8.2 37.2,29.39 36.65,29.19 35.92,29.12 v35.38,28.91
  other vias: 42.34,20.29 46.13,13.05 34.43,11.32 22.31,38.85 48.17,22.74 33.98,16.72 32.56,42.57 16.71,41.94 20.93,43.33 9.75,31.94 16.76,23.01 32.82,39.42 29.16,42.57 28.63,46.95 36.06,49.29 18.13,46.82 1.83,33.78 4.57,33.99 9.7,39.01 36.7,29.39 23.06,41.35 26.27,46.38 35.48,43.13 19.44,38.62 40.61,12.99 43.38,12.85 21.49,10.57 25.3,10.41 41.16,8.81 28.28,41.12 20.71,37.51 31.27,11.24 50.2,8.88 45.83,16.3 44.77,14.9 24.72,1.88 38.4,39.37 41.21,39.93 37.08,12.85 45.89,15.12 33.97,23.15 36.69,23.83 26.26,38.86 25.3,25.25 25.01,36.99 20.57,24.9 37.03,40.54 39.62,40.46 36.4,47.5 7.29,45.09 4.88,39.12 16.66,17.73 9.14,17.42 44.47,48.99 39.86,46.96 42.92,46.87 14.79,29.81 16.48,28.69 13.14,27.65 25.72,20.71 32.5,23.53 37.77,22.41 39.57,20.27 32.26,15.26 35.07,15.3 35.51,16.44 38.97,15.79 28.6,14.4 31.24,20.3 44.4,16.03 19.94,21.28 14.91,19.63 14.74,14.42 23.28,14.04 9.82,12.1 5.59,9.89 10.33,26.92 10.88,24.21 18.57,6.84 25.43,7.52 29.46,7.35 40.85,4.89 10.89,43.91 12.88,46.58 5.89,42.38 15.93,48.96 12.4,35.82 5.02,30.37 2.34,31.58 1.81,36.45 4.41,37.67 5.52,26.28 6.96,20.63 4.49,21.34 4.11,23.99 6.62,5.92 10.65,4.02 17.79,4.02 36.38,5.15 34.28,8.15 33.28,41.22 39.78,42.19
  pour Top: 0.3,50.57 50.44,50.52 50.53,0.25 0.45,0.39 0.5,4.1
  pour Bottom: 0.19,50.62 50.44,50.62 50.69,-0.06 0.3,0.34 0.4,1.3
I2C1_SCL  (via drill 0.23)
  Top 0.203: U10.61 24.03,26.97 24.49,26.16 26.21,26.16 26.67,26.06 26.67,24.89 26.77,24.79 R14.2 | U2.2 v33.98,13.87 | 42.27,12.7 v42.22,12.8
  Top 0.254: v29.28,15.89 27.09,17.19 27.04,17.25 27.05,24.66 R14.2 | 42.27,12.7 42.27,11.1 42.56,10.8 U1.2 | v33.98,13.87 33.58,13.87 33.07,14.38 32.43,14.38 U4.8 32.22,14.59 | U5.6 33.23,19.56 32.95,19.35 v32.92,16.75
  Bottom 0.254: 33.02,15.9 33.88,15.91 34.39,15.41 34.39,14.49 34.36,14.46 v33.98,13.87 41.35,13.87 42.27,12.95 v42.22,12.8 | 33.02,15.9 v29.28,15.89 | v32.92,16.75 32.93,15.99 33.02,15.9
I2C1_SDA  (via drill 0.23)
  Top 0.203: 34.1,10.13 33.34,10.86 33.3,10.93 33.3,13.16 | U10.62 24.53,27.18 24.79,26.57 27.18,26.57 27.69,25.81 27.69,23.57 | 29.78,23.11 R13.2 30.18,22.91 30.2,22.89 v30.65,22.96
  Top 0.254: U2.3 33.3,13.16 32.4,13.16 U4.7 32.28,13.09 31.53,13.09 31.11,13.51 31.11,15.89 31.18,16 | 29.78,23.11 29.6,22.7 27.84,22.7 27.69,22.55 | 34.1,10.13 43.38,10.14 43.8,10.01 U1.3 | 31.18,16 30.65,15.99 29.76,16.77 29.01,16.77 28.48,17.3 27.93,17.3 27.69,17.55 27.69,22.55 | U5.5 34.82,17.48 34.82,16.6 34.38,16 31.18,16 | 27.69,23.57 27.69,22.55
LED_GPS_SIGNAL  (via drill 0.23)
  Top 0.254: v11.63,10.04 11.63,9.11 11.35,8.83 5.17,8.88 R21.1
  Bottom 0.254: v11.63,10.04 11.61,14.37 12.47,15.31 12.79,15.49 12.93,15.51 13.89,15.51 U$4.6
LED_MOTOR_ARM  (via drill 0.25, 0.51)
  Top 0.203: U10.36 15.01,36.49 14.43,37.08 14.43,37.94 13.6,38.51 11.06,38.51 8.89,36.32 6.71,36.31 6.35,36.32 5.83,36.06 5.65,35.08 4.28,35.09 3.86,34.87 3.54,34.68 3.53,30.4
  Top 0.254: 3.53,30.4 3.53,30.24 v3.83,29.35 | v5.42,12.17 4.21,12.17 R20.1
  Bottom 0.254: v3.83,29.35 1.28,29.36 0.62,28.89 0.63,12.54 0.63,12.39 0.85,12.18 v5.42,12.17
LED_SNSR_FAIL
  Top 0.254: U10.3 28.75,31.5 30.18,29.36 33.96,29.38 34.91,30.64 35.91,30.63 37.42,31.88 37.49,36.39 38.53,37.21 38.94,37.21 R16.1
LED_SNSR_ONLINE
  Top 0.254: R15.1 38.78,35.81 37.94,35.28 37.9,31.61 36.16,30.14 35.22,30.15 34.27,28.82 29.92,28.85 28.4,30.99 U10.2
LED_WIFI_CONNECT
  Top 0.254: U10.4 29.06,32 30.53,29.87 33.66,29.88 33.7,29.94 34.58,31.18 34.9,31.18 35.78,31.18 36.97,32.1 36.98,37.43 38.03,38.22 39.51,38.22 R17.1
MOT1_OUT
  Top 0.813: Q5.3 27.57,48.01 LEFT.4 29.62,48.26 D4.A
MOT2_OUT
  Top 0.61: 47.51,38.23 45.48,39.85 43.22,40.15
  Top 0.813: 47.51,38.23 FRONT.4 48.26,40.41 D5.A | 43.22,40.15 Q4.3
MOT3_OUT
  Top 0.406: 38.12,2.81 RIGHT.4 39.97,2.7 D7.A
  Top 0.61: Q3.3 38.12,2.81
MOT4_OUT
  Top 0.813: REAR.4 2.46,17.54 D6.A 5.51,19.21 5.67,19.32 5.66,21.91 5.12,24.35 5.07,24.8 5.07,24.98 Q2.3
N$1
  Top 0.203: D1.P$1 R2.1
N$3
  Top 0.254: C2.1 39.23,19.52 Q6.1 40.63,19.12 41.25,19.74 41.25,22.11 40.71,22.65 40.43,22.65 40.03,23.05 40.26,23.43 R30.1 40.3,23.52 40.57,23.79 40.57,24.36 U$2.9
N$4
  Top 0.203: D2.P$1 R3.1
N$5
  Top 0.203: 31.09,36.68 R1.2
  Top 0.254: U10.6 28.09,33.02 | 28.6,33.02 29.82,33.83 29.82,35.2 31.09,36.68
  Top 0.305: 28.09,33.02 28.6,33.02
N$6
  Top 0.203: D3.P$1 R6.1
N$7
  Top 0.254: U$2.10 41.66,24.59 R30.2 41.91,23.73 41.91,22.39 42.87,21.42 Q6.3 43.76,20.99 C3.1
N$8
  Top 0.254: C16.2 43.5,7.28 43.76,7.54 44.74,7.54 U1.6
N$9
  Top 0.406: OK.C R15.2
N$10
  Top 0.254: U$2.13 42.9,26.76 L3.2 43.15,27.61 L1.1
N$11
  Top 0.254: L2.1 46.24,25.54 46.24,24.75 46.05,24.56 C4.1 44.78,24.52 C5.1 42.32,25.1 U$2.11
N$12
  Top 0.406: U1.12 48.85,10.8 C15.1
N$13
  Top 0.406: U1.13 47.3,11.88 48.01,12.59 48.86,12.59 C15.2
N$14
  Top 0.406: ER.C R16.2
N$15
  Top 0.254: ARMED.C 4.11,13.88 R20.2
N$16
  Top 0.305: R11.2 37.56,46.3 38.6,47.34 39.29,47.34 39.8,47.85 39.8,49 LIPO.3
N$17
  Top 0.305: R9.2 40.8,47.07 40.99,47.26 40.99,48.97 LIPO.2
N$18
  Top 0.254: U$2.12 43.03,26.25 L3.1 44.8,25.68 L2.2
N$19
  Top 0.406: R17.2 ONLINE.C
N$20
  Top 0.254: L1.2 43.84,29.26 C7.1
N$21
  Top 0.203: POWER.C R19.2
N$22
  Top 0.254: U$2.16 41.2,28.65 41.68,29.12 41.66,30.19 R31.1
N$23
  Top 0.254: U$2.19 39.4,29.96 C8.1
N$25
  Top 0.254: U10.60 23.52,26.92 23.42,26.36 TP0.TP R23.2
N$27
  Top 0.254: 40.84,16.21 C22.2
  Top 0.305: U2.14 37.19,16.41 37.62,16.84 40.23,16.84 40.84,16.21
N$30
  Top 0.254: R21.2 1.79,7.01 GPS.C
N$31
  Top 0.254: U10.31 18.54,41.25 C26.2
N$32
  Top 0.254: U10.47 14.68,30.99 13.92,30.73 C27.1
N$45
  Top 0.406: Q5.1 32.69,43.98 33.2,44.49 33.2,45.17 R29.1
N$46
  Top 0.406: Q4.1 44.29,42.27 44.74,42.36 45.37,42.36 R28.1
N$47
  Top 0.254: Q2.1 7.84,24.19 8.93,25.28 8.93,27.25 8.54,27.64 R26.1
N$48
  Top 0.254: Q3.1 37.25,7.93 35.31,7.93 35.18,7.8 R27.1
OSC_IN
  Top 0.254: Q1.P$1 31.03,33.09
  Top 0.305: U10.5 29.77,32.51 31.03,33.09 C44.2
OSC_OUT
  Top 0.305: R1.1 C45.2 Q1.P$2
PWM_OUT_FRONT  (via drill 0.23)
  Top 0.254: v20.19,33.38 19.23,35.52 17.33,35.52 16.72,36 U10.37
  Top 0.406: R28.2 46.84,42.32 R24.2 46.85,40.95 46.85,41.3 47.58,42.03 50.02,42.03 50.22,41.83 50.22,31.33 49.51,30.62 48.27,30.62 FRONT.1
  Bottom 0.254: v20.19,33.38 20.48,33.38 20.85,33.95 26.21,33.95 26.25,33.9 26.83,33 27.53,32.09 27.94,31.53 38.22,31.52 38.24,31.52
  Bottom 0.305: 39.11,31.26 38.24,31.52
  Bottom 0.406: 39.11,31.26 40.5,32.03 45.12,32.03 45.84,31.66 46.35,31.41 47.14,30.61 FRONT.1
PWM_OUT_LEFT  (via drill 0.23)
  Top 0.203: v13.82,36.07 14.07,35.92 14.93,35.51 U10.38
  Top 0.254: 31.62,47.06 R25.2
  Top 0.406: R29.2 31.52,46.96 | 31.52,46.96 R25.2 | 31.52,46.96 31.52,49.59 30.96,50.32 20.22,50.32 19.66,49.53 19.66,48.3 LEFT.1
  Bottom 0.203: v13.82,36.07 13.87,44.81 14.43,45.36 19.71,45.36 19.71,48.24
  Bottom 0.254: 19.65,48.22 LEFT.1
  Bottom 0.406: 19.71,48.24 LEFT.1
PWM_OUT_REAR  (via drill 0.23, 0.25)
  Top 0.254: U10.40 17.16,34.5 v17.09,34.39 | REAR.1 2.84,25.28 3.85,26.28 3.85,27.52 R18.2 5.32,27.57 R26.2 5.55,27.81 v5.55,28.7
  Bottom 0.203: v17.09,34.39 16.91,34.38 16.24,34.12 8.24,34.11 7.14,33.14 7.11,29.45 v5.55,28.7
PWM_OUT_RIGHT  (via drill 0.23)
  Top 0.203: v23.93,6.33 24.03,19.05 23.37,19.66 19.3,19.66 18.64,20.22 v18.64,23.22 | U10.39 17.07,35 17.36,34.99 18.87,35 19.25,34.39 v19.25,33.49
  Top 0.254: R27.2 33.15,6.43 32.55,6.95 31.69,6.96 R22.2 30.91,6.89 30.24,6.28 30.25,2.84 RIGHT.1
  Bottom 0.203: 30.39,2.65 29.13,2.65 29.31,4.88 27.84,6.5 24.54,6.5 23.98,6.36 v23.93,6.33 | v19.25,33.49 20.82,30.77 20.81,26.66 18.64,24.91 v18.64,23.22
  Bottom 0.254: 30.39,2.65 RIGHT.1
RF24L01_IRQ  (via drill 0.23)
  Top 0.203: U$2.6 39.07,24.7 v38.42,24.05 | v26.38,23.09 25.49,23.09 25.19,22.79 23.31,22.79 23.16,22.94 22.93,23.15 22.07,24.01 22.07,26.7 22.55,27.18 22.55,28.48 U10.58
  Bottom 0.203: v38.42,24.05 37.45,24.05 36.22,24.89 30.02,24.89 v26.38,23.09
RF24L01_TX_RX  (via drill 0.23)
  Top 0.203: U$2.1 38.09,27.75 37.6,28.31 36.23,28.31 35.91,27.96 35.91,27.53 v35.57,27.07 | U10.59 23.03,29.42 v23.43,29.71
  Bottom 0.203: v35.57,27.07 35.57,26.99 30.78,26.99 30.17,27.61 25.84,32.2 24.5,32.2 24.5,32.19 24.5,32.17 24.38,32.04 23.45,30.96 23.46,30.02 23.48,29.77 v23.43,29.71
RN171D1  (via drill 0.23)
  Top 0.203: R2.2 39.87,34.34 v38.94,33.79
  Bottom 0.203: v38.94,33.79 29.77,33.73 29.46,34.09 29.46,35.41 U3.9
RN171D2  (via drill 0.23)
  Top 0.203: R3.2 v38.97,32.94
  Bottom 0.203: v38.97,32.94 29.06,32.97 28.19,33.88 28.19,35.41 U3.8
RN171D3  (via drill 0.23)
  Top 0.203: R6.2 39.82,31.98 v38.97,32.06
  Bottom 0.203: v38.97,32.06 28.25,32.05 26.9,33.93 26.92,35.41 U3.7
SPI1_MISO  (via drill 0.23)
  Top 0.203: U$2.5 37.92,25.31 v37.58,24.92 | U10.56 21.51,29.56 22.1,30.84 24.38,30.83 24.89,30.59 v25.27,29.86
  Bottom 0.203: v37.58,24.92 36.95,24.92 36.48,25.39 29.95,25.4 25.71,29.82 25.39,29.84 v25.27,29.86
SPI1_MOSI  (via drill 0.23)
  Top 0.203: U$2.4 37.27,26.19 v36.98,25.9 | U10.57 22.03,29.4 22.57,30.32 24.16,30.32 v24.39,29.73
  Bottom 0.203: v36.98,25.9 30.16,25.89 25.76,30.54 24.96,30.54 v24.39,29.73
SPI1_NSS  (via drill 0.23)
  Top 0.203: U$2.2 38.31,27.28 37.75,27.28 37.68,27.35 v36.84,27.66 | U10.20 24.03,39.04 23.91,38.94 23.88,38.91 21.89,37.93 21.89,32.96 22.25,32.54 23.84,32.56 v24.64,32.91
  Bottom 0.203: v36.84,27.66 36.81,27.66 36.05,27.69 31.06,27.68 25.87,32.87 24.67,32.87 v24.64,32.91
SPI1_SCK  (via drill 0.23)
  Top 0.203: U$2.3 37.72,26.78 v36.83,26.83 | U10.55 21.01,29.76 21.71,31.3 24.08,31.3 v24.7,31.46
  Bottom 0.203: v36.83,26.83 36.91,26.86 36.25,26.47 30.45,26.47 25.58,31.48 24.68,31.49 24.75,31.47 v24.7,31.46
UART_RX  (via drill 0.23, 0.25)
  Top 0.203: v22.75,33.2 22.76,37.5 23.62,38.15 25.04,38.15 25.6,38.56 25.6,40.02 U10.17 | v25.87,22.29 25.46,22.32 25.07,22.3 22.93,22.3 22.52,22.09 v22.32,22.02 22.61,22.15
  Bottom 0.203: U3.46 20.55,20.19 20.55,20.18 21.69,20.82 22.28,21.23 v22.32,22.02 21.78,23 21.79,32.39 22.25,33.18 v22.75,33.2 | RADIO.3 47.36,17.43 46.81,17.79 46.8,20.76 45.9,21.58 27.26,21.58 26.55,22.24 v25.87,22.29
UART_TX  (via drill 0.23, 0.25)
  Top 0.203: v23.67,33.18 23.63,33.92 23.62,37.23 24.09,37.57 24.14,37.61 26.37,37.62 26.67,38 U10.16 | v26.36,21.38 23.67,21.48 v23.66,21.47
  Bottom 0.203: U3.45 21.82,19.84 22.4,20.42 23.02,20.89 23.66,21.36 23.61,21.52 v23.66,21.47 | v23.66,21.47 23.66,21.56 | 23.66,21.56 23.25,22.06 22.26,23.22 22.26,31.71 22.88,32.52 23.37,32.83 v23.67,33.18 | RADIO.2 47.38,16.19 46.35,16.82 46.38,20.47 45.7,21.14 27.06,21.16 v26.36,21.38 | v23.66,21.47 23.66,21.33 23.66,21.56
USART1_GPS_RX  (via drill 0.23)
  Top 0.203: v17.37,30.58 17.37,32.56 16.92,33.02 U10.43
  Top 0.254: U$4.2 14.17,5.33 13.21,6.3 v13.21,25.09
  Bottom 0.203: v13.21,25.09 13.61,25.55 18.64,25.55 19.66,26.36 20.32,26.98 20.32,30.12 19.38,31.2 18.16,31.2 v17.37,30.58
USART1_GPS_TX  (via drill 0.23)
  Top 0.203: U10.42 17.25,33.5 18.3,32.73 v18.29,30.54
  Top 0.254: U$4.1 13.77,2.79 12.55,3.96 12.55,24.08 v12.09,24.99
  Bottom 0.203: v12.09,24.99 13.11,26.06 18.49,26.06 19.86,27.18 19.86,29.86 19.26,30.51 v18.29,30.54
USB_DM
  Top 0.254: R4.1 10.68,34.48 10.46,34.7 10.37,34.75 USB1.D-
USB_DM_IN
  Top 0.254: R4.2 12.94,34.31 13.11,34.34 14.07,34.34 15.24,32.51 15.99,32.46 U10.44
USB_DP
  Top 0.254: USB1.D+ 10.12,33.95 R5.1
USB_DP_IN
  Top 0.254: U10.45 15.04,32 14.28,32 13.92,32.41 R5.2
VIN_PROTECTED
  Top 0.305: R7.2 43.84,48.06 42.96,48.95 42.35,48.95 LIPO.1
WIFI_RESET  (via drill 0.23)
  Top 0.203: U10.26 20.98,39.01 21.43,38.04 21.43,32.6 22.15,31.88 v23.33,31.92
  Bottom 0.203: U3.40 28.09,19.81 27.84,20.02 25.3,20.02 24.31,21.73 22.83,23.42 22.81,28.79 22.8,31.26 23.18,31.66 v23.33,31.92

### Text on the board
tNames: W | 1 | GND | W | W | W
bNames: Software Logistics, LLC / Microelectronics Division / NiVek QC - Mini / Rev A | August 2013